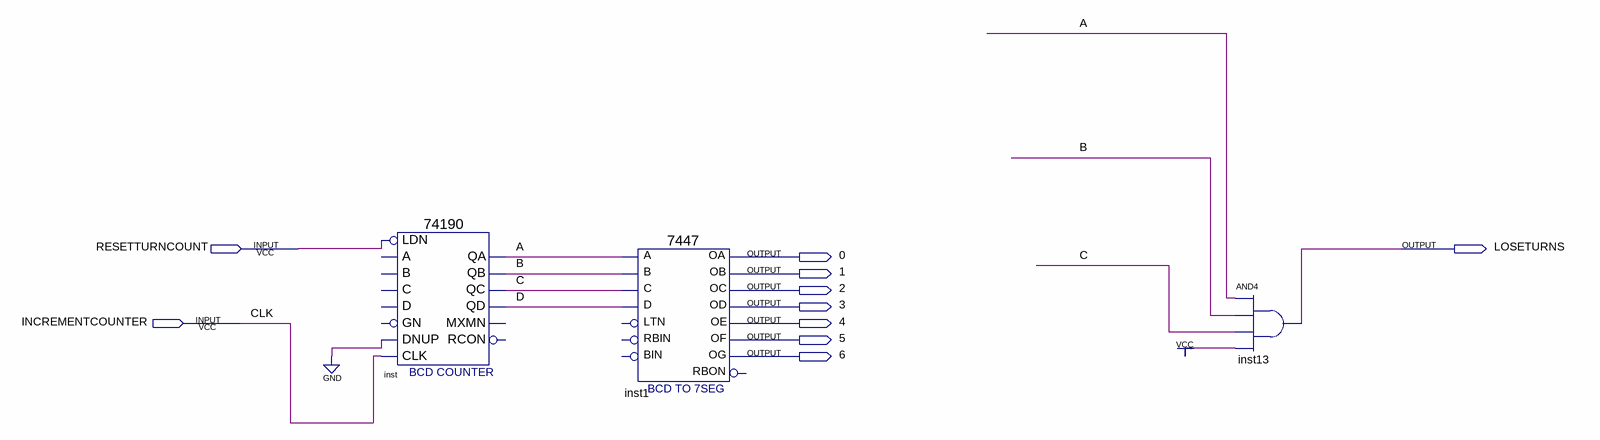
[diagram p0: schematic sheet]
// Quartus schematic turnCounter.bdf as structural Verilog: 3 symbols, 10 pins
module turnCounter (
  input  RESETTURNCOUNT,
  input  INCREMENTCOUNTER,
  output LOSETURNS,
  output \0 ,
  output \1 ,
  output \2 ,
  output \3 ,
  output \4 ,
  output \5 ,
  output \6 
);

  wire A, B, C, D;

  \74190  inst (
    .LDN(RESETTURNCOUNT), .CLK(INCREMENTCOUNTER), .DNUP(1'b0), .QA(A), .QB(B), .QD(D), .QC(C));  // open: A, C, B, D, GN, MXMN, RCON
  \7447  inst1 (
    .B(B), .C(C), .D(D), .A(A), .OB(\1 ), .OC(\2 ), .OE(\4 ), .OD(\3 ), .OF(\5 ), .OG(\6 ), .OA(\0 ));  // open: LTN, RBIN, BIN, RBON
  and inst13 (LOSETURNS, A, B, C, 1'b1);

  // Other names for the same wires on the sheet: CLK = INCREMENTCOUNTER
endmodule
